# Altium schematic sheet ReboostV2_Power.SchDoc: Power Supply
size 420 x 297 mm; SheetNumber: 9
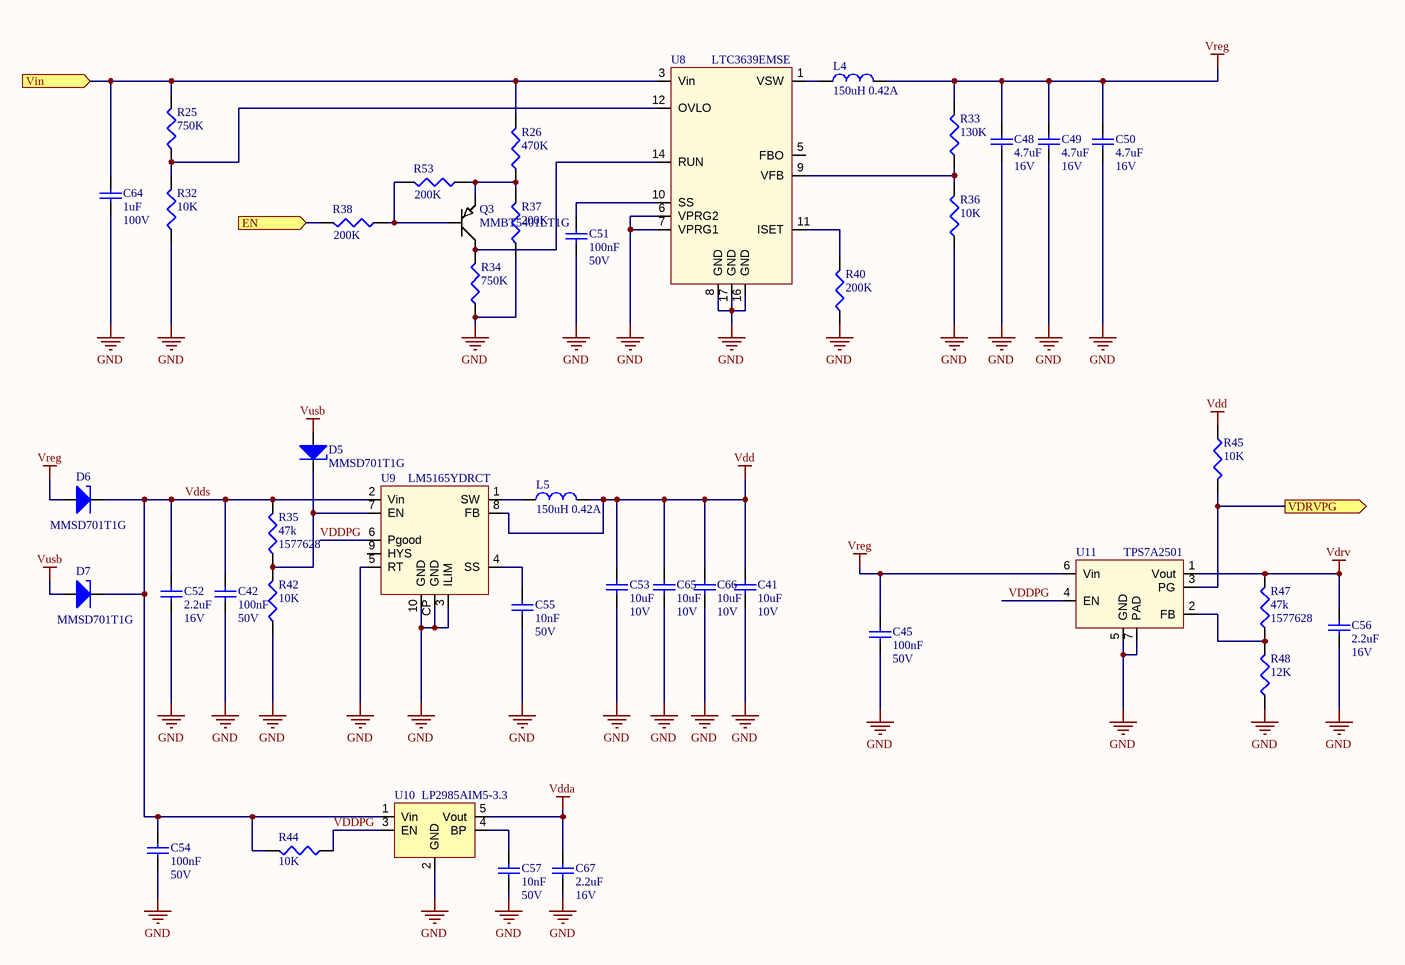
[diagram p0: ReboostV2_Power.SchDoc]

## Parts
C41  10uF  Voltage Rating: 10V  [C-0805]
C42  100nF  Voltage Rating: 50V  [C0603]
C45  100nF  Voltage Rating: 50V  [C0603]
C48  4.7uF  Voltage Rating: 16V  [C-0805]
C49  4.7uF  Voltage Rating: 16V  [C-0805]
C50  4.7uF  Voltage Rating: 16V  [C-0805]
C51  100nF  Voltage Rating: 50V  [C0603]
C52  2.2uF  Voltage Rating: 16V  [C0603]
C53  10uF  Voltage Rating: 10V  [C-0805]
C54  100nF  Voltage Rating: 50V  [C0603]
C55  10nF  Voltage Rating: 50V  [C0603]
C56  2.2uF  Voltage Rating: 16V  [C0603]
C57  10nF  Voltage Rating: 50V  [C0603]
C64  1uF  Voltage Rating: 100V  [C-1206]
C65  10uF  Voltage Rating: 10V  [C-0805]
C66  10uF  Voltage Rating: 10V  [C-0805]
C67  2.2uF  Voltage Rating: 16V  [C0603]
D5  MMSD701T1G  [SOD123 - B]
D6  MMSD701T1G  [SOD123 - B]
D7  MMSD701T1G  [SOD123 - B]
L4  150uH 0.42A  [WE-TPC 4828, MH]
L5  150uH 0.42A  [WE-TPC 4828, MH]
Q3  MMBT5401LT1G  [SOT-23]
R25  750K  [0603]
R26  470K  [0603]
R32  10K  [0603]
R33  130K  [0603]
R34  750K  [0603]
R35  47k  Supplier Part Number 1: 1577628  [0603]
R36  10K  [0603]
R37  200K  [0603]
R38  200K  [0603]
R40  200K  [0603]
R42  10K  [0603]
R44  10K  [0603]
R45  10K  [0603]
R47  47k  Supplier Part Number 1: 1577628  [0603]
R48  12K  [0603]
R53  200K  [0603]
U8  LTC3639EMSE  [MSE1612]
U9  LM5165YDRCT  [PWSON10]
U10  LP2985AIM5-3.3  [SOT-23-5]
U11  TPS7A2501  [WSON-6]

## Ports
EN (in), VDRVPG (out), Vin (in)

## Nets
GND: C41.1 C42.1 C45.1 C48.1 C49.1 C50.1 C51.1 C52.1 C53.1 C54.1 C55.1 C56.1 C57.1 C64.1 C65.1 C66.1 C67.1 R32.1 R34.1 R36.1 R37.1 R40.1 R42.1 R48.1 U8.6(VPRG2) U8.7(VPRG1) U8.8(GND) U8.16(GND) U8.17(GND) U9.3(ILIM) U9.5(RT) U9.10(GND) U9.CP(GND) U10.2(GND) U11.5(GND) U11.7(PAD)
Vdd: C41.2 C53.2 C65.2 C66.2 L5.2 R45.1 U9.8(FB)
Vdda: C67.2 U10.5(Vout)
Vdrv: C56.2 R47.2 U11.1(Vout)
Vreg: C45.2 C48.2 C49.2 C50.2 D6.1(A) L4.2 R33.2 U11.6(Vin)
Vusb: D5.1(A) D7.1(A)
EN: R38.2 ; port EN
VDDPG: R44.1 U9.6(Pgood) U10.3(EN) U11.4(EN)
Vdds: C42.2 C52.2 C54.2 D6.2(K) D7.2(K) R35.2 R44.2 U9.2(Vin) U10.1(Vin)
VDRVPG: R45.2 U11.3(PG) ; port VDRVPG
Vin: C64.2 R25.2 R26.2 U8.3(Vin) ; port Vin
NetC51_2: C51.2 U8.10(SS)
NetC55_2: C55.2 U9.4(SS)
NetC57_2: C57.2 U10.4(BP)
NetD5_2: D5.2(K) R35.1 R42.2 U9.7(EN)
NetL4_1: L4.1 U8.1(VSW)
NetL5_1: L5.1 U9.1(SW)
NetQ3_1: Q3.1 R38.1 R53.2
NetQ3_2: Q3.2 R26.1 R37.2 R53.1
NetQ3_3: Q3.3 R34.2 U8.14(RUN)
NetR25_1: R25.1 R32.2 U8.12(OVLO)
NetR33_1: R33.1 R36.2 U8.9(VFB)
NetR40_2: R40.2 U8.11(ISET)
NetR47_1: R47.1 R48.2 U11.2(FB)

Not connected (* = marked no-connect by the designer): U8 5(FBO); U9 9(HYS)

## Notes on the sheet
- PROJECT
- www.tpee.nl <http://www.tpee.nl>
- TITLE
- FILE NAME
- A3
- SIZE
- Author:
- SHEET
- OF

## Library data of the parts
C41 C53 C65 C66 = 10uF/0805/CER/10V: Capacitor, 10uF, 10V, X7R; Capacitance Tolerance: ± 10%; Capacitor Case Style: 0805; Brand Number: GRM21BR71A106KE51L; Brand: MURATA; Dielectric Characteristic: X7R; Capacitance: 10uF; Temperature Range: -55°C to +125°C; Price: 0,36; Order Code Supplier: 1828828; Supplier: Farnell; Manufacturer: MURATA; Manufacturer Part Number: GRM21BR71A106KE51L
C42 C45 C51 C54 = 100nF/0603/CER/50V: Capacitor, 100nF, 50V, X7R; Capacitance Tolerance: ± 10%; Capacitor Case Style: 0603; Brand Number: MCCA000255; Brand: MULTICOMP; Dielectric Characteristic: X7R; Capacitance: 100nF; Temperature Range: -55°C to +125°C; Price: 0,008; Order Code Supplier: 1759122RL; Supplier: Farnell; Manufacturer: MULTICOMP; Manufacturer Part Number: MCCA000255
C48-C50 = 4.7uF/0805/CER/16V: Capacitor, 4.7uF, 16V, X7R; Capacitance Tolerance: ± 10%; Capacitor Case Style: 0805; Brand Number: GRM21BR71C475KA73L; Brand: MURATA; Dielectric Characteristic: X7R; Capacitance: 4.7uF; Temperature Range: -55°C to +125°C; Price: 0,26; Order Code Supplier: 1797015; Supplier: Farnell; Manufacturer: MURATA; Manufacturer Part Number: GRM21BR71C475KA73L
C52 C56 C67 = 2.2uF/0603/CER/16V: Capacitor, 2.2uF, 16V, X5R; Capacitance Tolerance: +/- 10%; Capacitor Case Style: 0603; Brand Number: GRM188R61C225KE15D; Brand: MURATA; Dielectric Characteristic: X5R; Capacitance: 2.2uF; Temperature Range: -55°C to 85°C; Price: 0,077; Order Code Supplier: 1735526; Supplier: Farnell; Manufacturer: MURATA; Manufacturer Part Number: GRM188R61C225KE15D
C55 C57 = 10nF/0603/CER/50V: Capacitor, 10nF, 50V, X7R; Capacitance Tolerance: ± 10%; Capacitor Case Style: 0603; Brand Number: C0603C103K5RACTU; Brand: KEMET; Dielectric Characteristic: X7R; Capacitance: 10nF; Temperature Range: -55°C to +125°C; Price: 0,011; Order Code Supplier: 1414609; Supplier: Farnell; Manufacturer: KEMET; Manufacturer Part Number: C0603C103K5RACTU
C64 = 1uF/1206/CER/100V: Capacitor, 1uF, 100V, X7R; Capacitance Tolerance: ± 10%; Capacitor Case Style: 1206; Brand Number: 12061C105K4Z2A; Brand: AVX; Dielectric Characteristic: X7R; Capacitance: 1uF; Temperature Range: -55°C to +125°C; Price: 0,52; Order Code Supplier: 1833855; Supplier: Farnell; Manufacturer: AVX; Manufacturer Part Number: 12061C105K4Z2A
D5-D7 = MMSD701T1G: Diode Schottky, Vrrm: 70V, If: 0.2A, Vf: 0.5V; Manufacturer: ON SEMICONDUCTOR; Case Style: SOD-123; Forward Current: 0.2A; Forward Voltage: 0.5V; Order Code Supplier: 1431102; Price: 0,115; Supplier: Farnell; Temperature Range: -55°C to +125°C; Vrrm: 70V; MPN: MMSD701T1G; Manufacturer Part Number: MMSD701T1G
L4 L5 = 744043151: 150UH, 30%, 0.42A; Manufacturer: Wurth Elektronik; Brand: Wurth; Case Style: WE-TPC 4828; DC Resistance: 0.770ohm; Brand Number: 744043151; DC Current: 0.42A; Inductance: 150uH; Order Code Supplier: 2082517; Price: 1,36; Q Factor: *; Supplier: Farnell; Temperature Range: -40°C to +125°C; Manufacturer Part Number: 744043151
Q3 = MMBT5401LT1G: Transistor, PNP, Vce:-150V, Vcb:-160V, Veb:-5V, Ic:-0,5A, Hfe:60 to 240; Brand: ON SEMICONDUCTOR; Collector Current: -0.5A; Collector Emittor Voltage: 160V; Base Emittor Voltage: 6V; Brand Number: MMBT5401LT1G; Case Style: SOT-23; Hfe: 60 to 240; Order Code Supplier: 1459108; Price: 0,041; Supplier: Farnell; Temperature Range: -55°C to +150°C; Transistor Polarity: PNP; Manufacturer: ON SEMICONDUCTOR; Manufacturer Part Number: MMBT5401LT1G
R25 R34 = 750K/0603/0063W/50V: Resistor, 750K, 1%, 0.063W, 50V, 100PPM, 0603; Brand: VISHAY DRALORIC; Brand Number: CRCW0603750KFKEA; Case Style: 0603; Order Code Supplier: 2122731; Power Rating: 0.063W; Price: 0,038; Resistance: 750K; Supplier: Farnell; Temperature Coefficient: ± 100PPM; Temperature Range: -55°C to +125°C; Voltage Rating: 50V; Manufacturer: VISHAY DRALORIC; Manufacturer Part Number: CRCW0603750KFKEA
R26 = 470K/0603/0063W/50V: Resistor, 470K, 1%, 0.063W, 50V, 100PPM, 0603; Brand: VISHAY DRALORIC; Brand Number: CRCW0603470KFKEA; Case Style: 0603; Order Code Supplier: 2122703; Power Rating: 0.063W; Price: 0,038; Resistance: 470K; Supplier: Farnell; Temperature Coefficient: ± 100PPM; Temperature Range: -55°C to +125°C; Voltage Rating: 50V; Manufacturer: VISHAY DRALORIC; Manufacturer Part Number: CRCW0603470KFKEA
R32 R36 R42 R44 R45 = 10K/0603/0063W/50V: Resistor, 10K, 1%, 0.063W, 50V, 100PPM, 0603; Brand: VISHAY DRALORIC; Brand Number: CRCW060310K0FKEA; Case Style: 0603; Order Code Supplier: 2122493; Power Rating: 0.063W; Price: 0,038; Resistance: 10K; Supplier: Farnell; Temperature Coefficient: ± 100PPM; Temperature Range: -55°C to +125°C; Voltage Rating: 50V; Manufacturer: VISHAY DRALORIC; Manufacturer Part Number: CRCW060310K0FKEA
R33 = 130K/0603/0063W/50V: Resistor, 130K, 1%, 0.063W, 50V, 100PPM, 0603; Brand: VISHAY DRALORIC; Brand Number: CRCW0603130KFKEA; Case Style: 0603; Order Code Supplier: 2122632; Power Rating: 0.063W; Price: 0,017; Resistance: 130K; Supplier: Farnell; Temperature Coefficient: ± 100PPM; Temperature Range: -55°C to +125°C; Voltage Rating: 50V; Manufacturer: VISHAY DRALORIC; Manufacturer Part Number: CRCW0603130KFKEA
R35 R47 = 47K/0603/0063W/50V_1: Resistor, 47K, 0.1%, 0.063W, 50V, 100PPM, 0603; Manufacturer: PANASONIC; Manufacturer Part Number: ERA3AEB473V; Case Style: 0603; Order Code Supplier: ERA3AEB473V; Power Rating: 0.063W; Resistance: 47k; Supplier: Farnell; Temperature Coefficient: ± 100PPM; Temperature Range: -55°C to +125°C; Voltage Rating: 50V; Supplier 1: Farnell
R37 R38 R53 = 200K/0603/0063W/50V: Resistor, 200K, 1%, 0.063W, 50V, 100PPM, 0603; Brand: VISHAY DRALORIC; Brand Number: CRCW0603200KFKEA; Case Style: 0603; Order Code Supplier: 2122655; Power Rating: 0.063W; Price: 0,038; Resistance: 200K; Supplier: Farnell; Temperature Coefficient: ± 100PPM; Temperature Range: -55°C to +125°C; Voltage Rating: 50V; Manufacturer: VISHAY DRALORIC; Manufacturer Part Number: CRCW0603200KFKEA
R40 = 200K/0603/0100W/75V: Resistor, 200K, 1%, 0.1W, 75V, 100PPM, 0603; Brand: VISHAY DRALORIC; Brand Number: CRCW0603200KFKEA; Case Style: 0603; Order Code Supplier: 2122655; Power Rating: 0.1W; Price: 0,022; Resistance: 200K; Supplier: Farnell; Temperature Coefficient: ± 100PPM; Temperature Range: -55°C to +155°C; Voltage Rating: 75V; Manufacturer: VISHAY DRALORIC; Manufacturer Part Number: CRCW0603200KFKEA
R48 = 12K/0603/0063W/50V: Resistor, 12K, 1%, 0.063W, 50V, 100PPM, 0603; Brand: VISHAY DRALORIC; Brand Number: CRCW060312K0FKEA; Case Style: 0603; Order Code Supplier: 2122501; Power Rating: 0.063W; Price: 0,0006; Resistance: 12K; Supplier: Farnell; Temperature Coefficient: ± 1%; Temperature Range: -55°C to +125°C; Voltage Rating: 50V; Manufacturer: VISHAY DRALORIC; Manufacturer Part Number: CRCW060312K0FKEA
U8 = LTC3639EMSE: High Efficiency, 150V 100mA Synchronous Step-Down Regulator; Manufacturer: Analog Devices Inc.; Manufacturer Part Number: LTC3639EMSE#PBF; ComponentLink1Description: New link; ComponentLink1URL: *
U9 = LM5165Y: Buck Vreg 150mA 3V3 out 5-65Vin; Brand: Texas Instruments; Case Style: MSOP-8; Price: 3,70; Order Code Supplier: 595-LM5165YDRCT; Brand Number: LM5165YDRCT; Temperature Range: -40°C to +85°C; Supplier: Mouser; Manufacturer: Texas Instruments; Manufacturer Part Number: LM5165YDRCT
U10 = LP2985AIM5-3.3: LDO, 0.3VDO, 3.3V, 0.15A, 1%; Brand: TEXAS INSTRUMENTS; Brand Number: LP2985AIM5-3.3/NOPB; Vin-min: 3.6V; Vin-max: 5.5V; Case Style: SOT-23-5; Current: 0.15A; Vout: 3.3V; Order Code Supplier: 1469134; Price: 0,73; Supplier: Farnell; Temperature Range: -40°C to +85°C; Manufacturer: TEXAS INSTRUMENTS; Manufacturer Part Number: LP2985AIM5-3.3/NOPB
U11 = TPS7A2501DRVT: TPS7A25 300-mA,18-V, Ultra-LowIQ, Low-DropoutLinearVoltageRegulatorWith Power-Good; Manufacturer: Texas Instruments; Supplier 1: Digi-Key; Supplier 2: Mouser; Supplier Part Number 1: 296-TPS7A2501DRVTCT-ND; Supplier Part Number 2: 595-TPS7A2501DRVT; MPN: TPS7A2501DRVT; Manufacturer Part Number: TPS7A2501DRVT